# EAGLE schematic Acti_champ_cable (EAGLE 9.3.0)
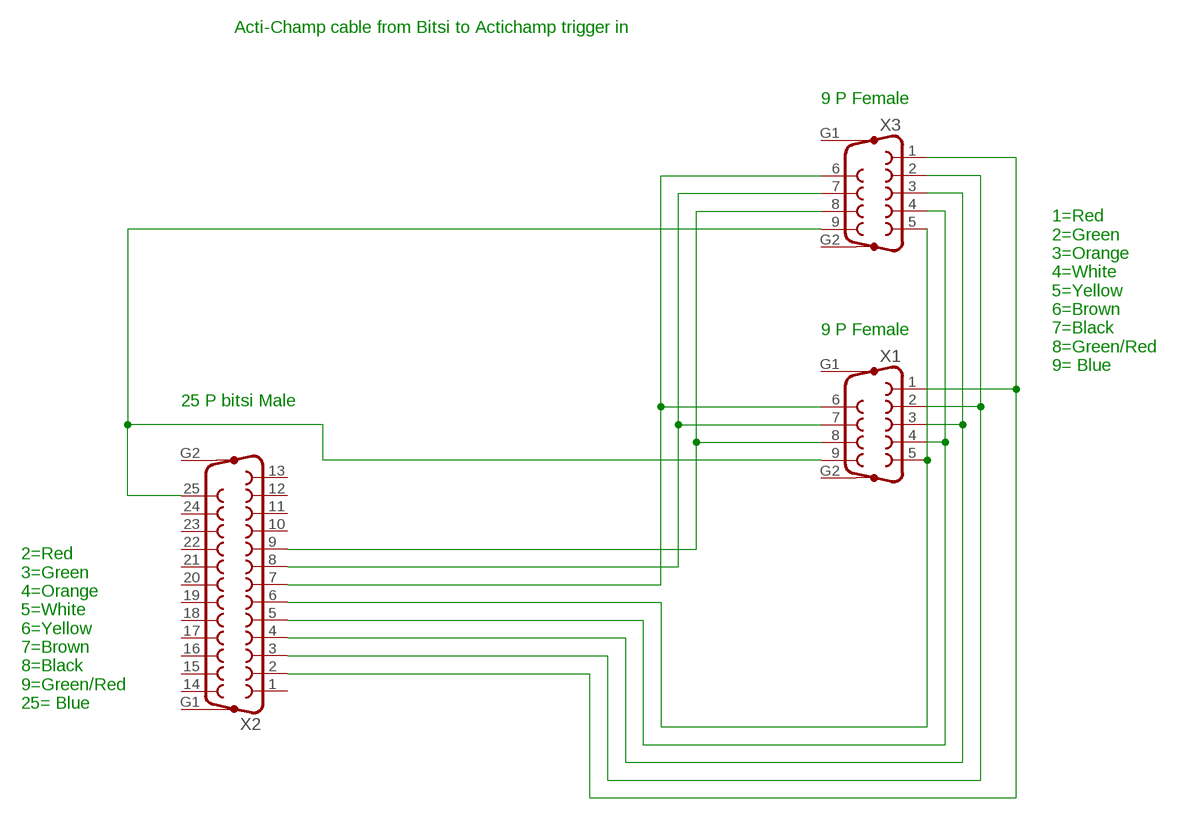
[diagram p0: schematic, sheet 1]

## Parts
X1  F09HP  [F09HP]
X2  F25HP  [F25HP]
X3  F09HP  [F09HP]

## Nets
N$1: X1.1 X2.2 X3.1
N$2: X1.2 X2.3 X3.2
N$3: X1.3 X2.4 X3.3
N$4: X1.4 X2.5 X3.4
N$5: X1.5 X2.6 X3.5
N$6: X1.6 X2.7 X3.6
N$7: X1.7 X2.8 X3.7
N$8: X1.8 X2.9 X3.8
N$10: X1.9 X2.25 X3.9
Unconnected: X1.G1 X1.G2 X2.1 X2.10 X2.11 X2.12 X2.13 X2.14 X2.15 X2.16 X2.17 X2.18 X2.19 X2.20 X2.21 X2.22 X2.23 X2.24 X2.G1 X2.G2 X3.G1 X3.G2

## Notes on the sheet
- Acti-Champ cable from Bitsi to Actichamp trigger in
- 9 P Female
- 9 P Female
- 1=Red
  2=Green
  3=Orange
  4=White
  5=Yellow
  6=Brown
  7=Black
  8=Green/Red
  9= Blue
- 25 P bitsi Male
- 2=Red
  3=Green
  4=Orange
  5=White
  6=Yellow
  7=Brown
  8=Black
  9=Green/Red
  25= Blue

## Library data of the parts
X1 X3 = con-subd:F09HP: SUB-D; OC_FARNELL: unknown; OC_NEWARK: unknown
X2 = con-subd:F25HP: SUB-D; OC_FARNELL: unknown; OC_NEWARK: unknown